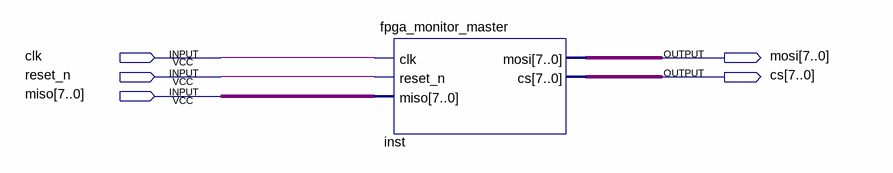
[diagram p0: schematic sheet]
// Quartus schematic fpga_monitor_master_uart.bdf as structural Verilog: 1 symbols, 5 pins
module fpga_monitor_master_uart (
  input  clk,
  input  reset_n,
  input  [7:0] miso,
  output [7:0] mosi,
  output [7:0] cs
);

  fpga_monitor_master inst (.clk(clk), .reset_n(reset_n), .miso(miso), .mosi(mosi), .cs(cs));
endmodule
